# Altium schematic sheet LAN9252.SchDoc
size B
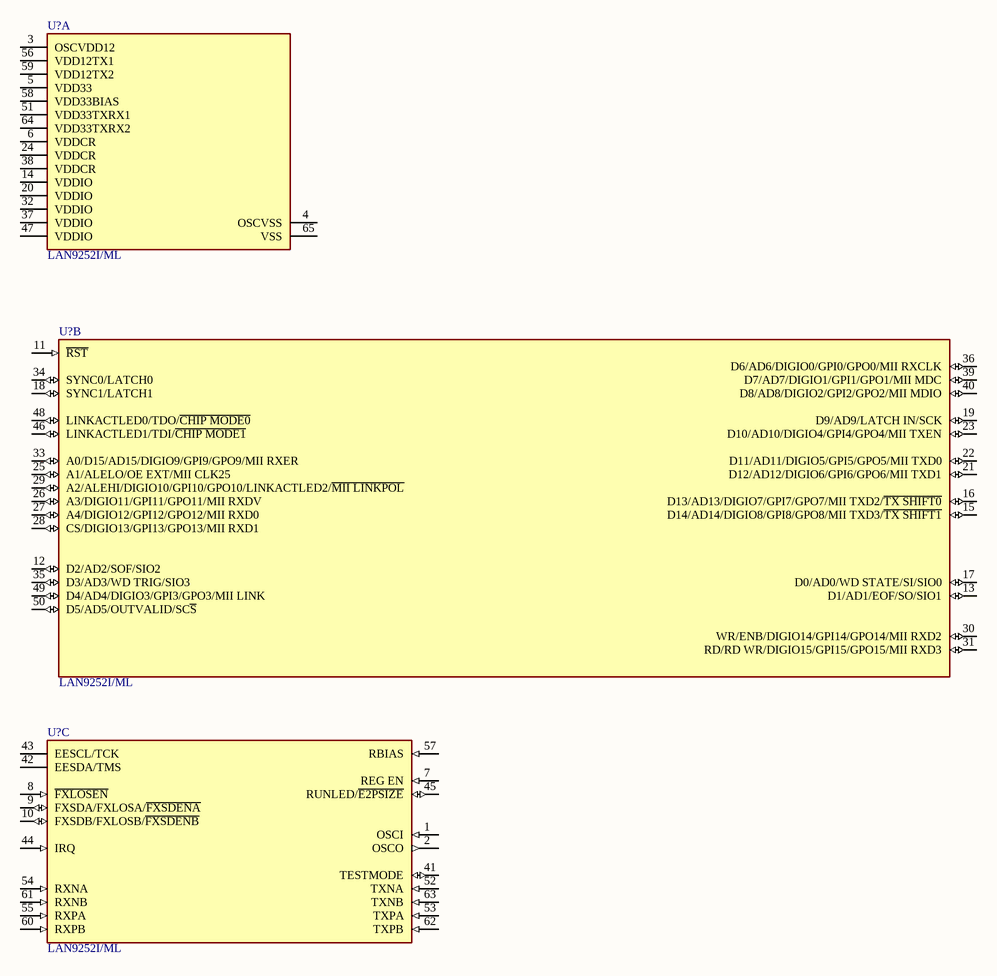
[diagram p0: LAN9252.SchDoc]

## Parts
(Parts that share a designator on the sheet are numbered #1, #2 ... from top to bottom, then left to right.)
U?#1  LAN9252I/ML  [FP-LAN9252I-ML-IPC_C]  (part A of 3)
U?#2  LAN9252I/ML  [FP-LAN9252I-ML-IPC_C]  (part B of 3)
U?#3  LAN9252I/ML  [FP-LAN9252I-ML-IPC_C]  (part C of 3)

## Nets

Not connected (* = marked no-connect by the designer): U?#1 3(OSCVDD12) 4(OSCVSS) 5(VDD33) 6(VDDCR) 14(VDDIO) 20(VDDIO) 24(VDDCR) 32(VDDIO) 37(VDDIO) 38(VDDCR) 47(VDDIO) 51(VDD33TXRX1) 56(VDD12TX1) 58(VDD33BIAS) 59(VDD12TX2) 64(VDD33TXRX2) 65(VSS); U?#2 11(~{RST}) 12(D2/AD2/SOF/SIO2) 13(D1/AD1/EOF/SO/SIO1) 15(D14/AD14/DIGIO8/GPI8/GPO8/MII_TXD3/~{TX_SHIFT1}) 16(D13/AD13/DIGIO7/GPI7/GPO7/MII_TXD2/~{TX_SHIFT0}) 17(D0/AD0/WD_STATE/SI/SIO0) 18(SYNC1/LATCH1) 19(D9/AD9/LATCH_IN/SCK) 21(D12/AD12/DIGIO6/GPI6/GPO6/MII_TXD1) 22(D11/AD11/DIGIO5/GPI5/GPO5/MII_TXD0) 23(D10/AD10/DIGIO4/GPI4/GPO4/MII_TXEN) 25(A1/ALELO/OE_EXT/MII_CLK25) 26(A3/DIGIO11/GPI11/GPO11/MII_RXDV) 27(A4/DIGIO12/GPI12/GPO12/MII_RXD0) 28(CS/DIGIO13/GPI13/GPO13/MII_RXD1) 29(A2/ALEHI/DIGIO10/GPI10/GPO10/LINKACTLED2/~{MII_LINKPOL}) 30(WR/ENB/DIGIO14/GPI14/GPO14/MII_RXD2) 31(RD/RD_WR/DIGIO15/GPI15/GPO15/MII_RXD3) 33(A0/D15/AD15/DIGIO9/GPI9/GPO9/MII_RXER) 34(SYNC0/LATCH0) 35(D3/AD3/WD_TRIG/SIO3) 36(D6/AD6/DIGIO0/GPI0/GPO0/MII_RXCLK) 39(D7/AD7/DIGIO1/GPI1/GPO1/MII_MDC) 40(D8/AD8/DIGIO2/GPI2/GPO2/MII_MDIO) 46(LINKACTLED1/TDI/~{CHIP_MODE1}) 48(LINKACTLED0/TDO/~{CHIP_MODE0}) 49(D4/AD4/DIGIO3/GPI3/GPO3/MII_LINK) 50(D5/AD5/OUTVALID/SC~{S}); U?#3 1(OSCI) 2(OSCO) 7(REG_EN) 8(~{FXLOSEN}) 9(FXSDA/FXLOSA/~{FXSDENA}) 10(FXSDB/FXLOSB/~{FXSDENB}) 41(TESTMODE) 42(EESDA/TMS) 43(EESCL/TCK) 44(IRQ) 45(RUNLED/~{E2PSIZE}) 52(TXNA) 53(TXPA) 54(RXNA) 55(RXPA) 57(RBIAS) 60(RXPB) 61(RXNB) 62(TXPB) 63(TXNB)

## Library data of the parts
U?#1-U?#3 = CMP-06281-000032-1: IC ETHERCAT CTLR 10/100 64QFN; Data Rate: 100Mbps; Max Power Dissipation: 821mW; Interface: I2C; Case/Package: QFN; Number of Pins: 64; Packaging: Tray; Mount: Surface Mount; Max Operating Temperature: 85°C; RoHS Compliant: Yes; Length: 9mm; Lead Free: Lead Free; Width: 9mm; Height: 0.95mm; Min Operating Temperature: -40°C; Contact Plating: Tin